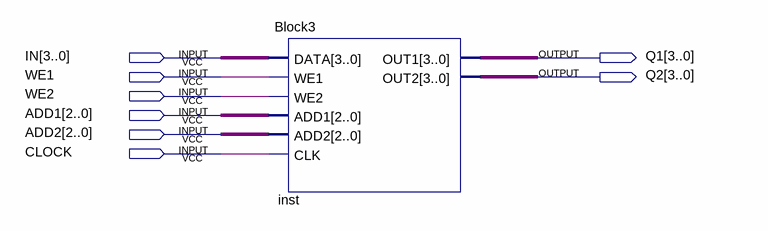
[diagram p0: schematic sheet]
// Quartus schematic Block1.bdf as structural Verilog: 1 symbols, 8 pins
module Block1 (
  input  [3:0] IN,
  input  WE1,
  input  WE2,
  input  [2:0] ADD1,
  input  [2:0] ADD2,
  input  CLOCK,
  output [3:0] Q1,
  output [3:0] Q2
);

  Block3 inst (.DATA(IN), .WE1(WE1), .WE2(WE2), .ADD1(ADD1), .ADD2(ADD2), .CLK(CLOCK), .OUT1(Q1), .OUT2(Q2));
endmodule
